# Altium schematic sheet Sheet1.SchDoc
size A4
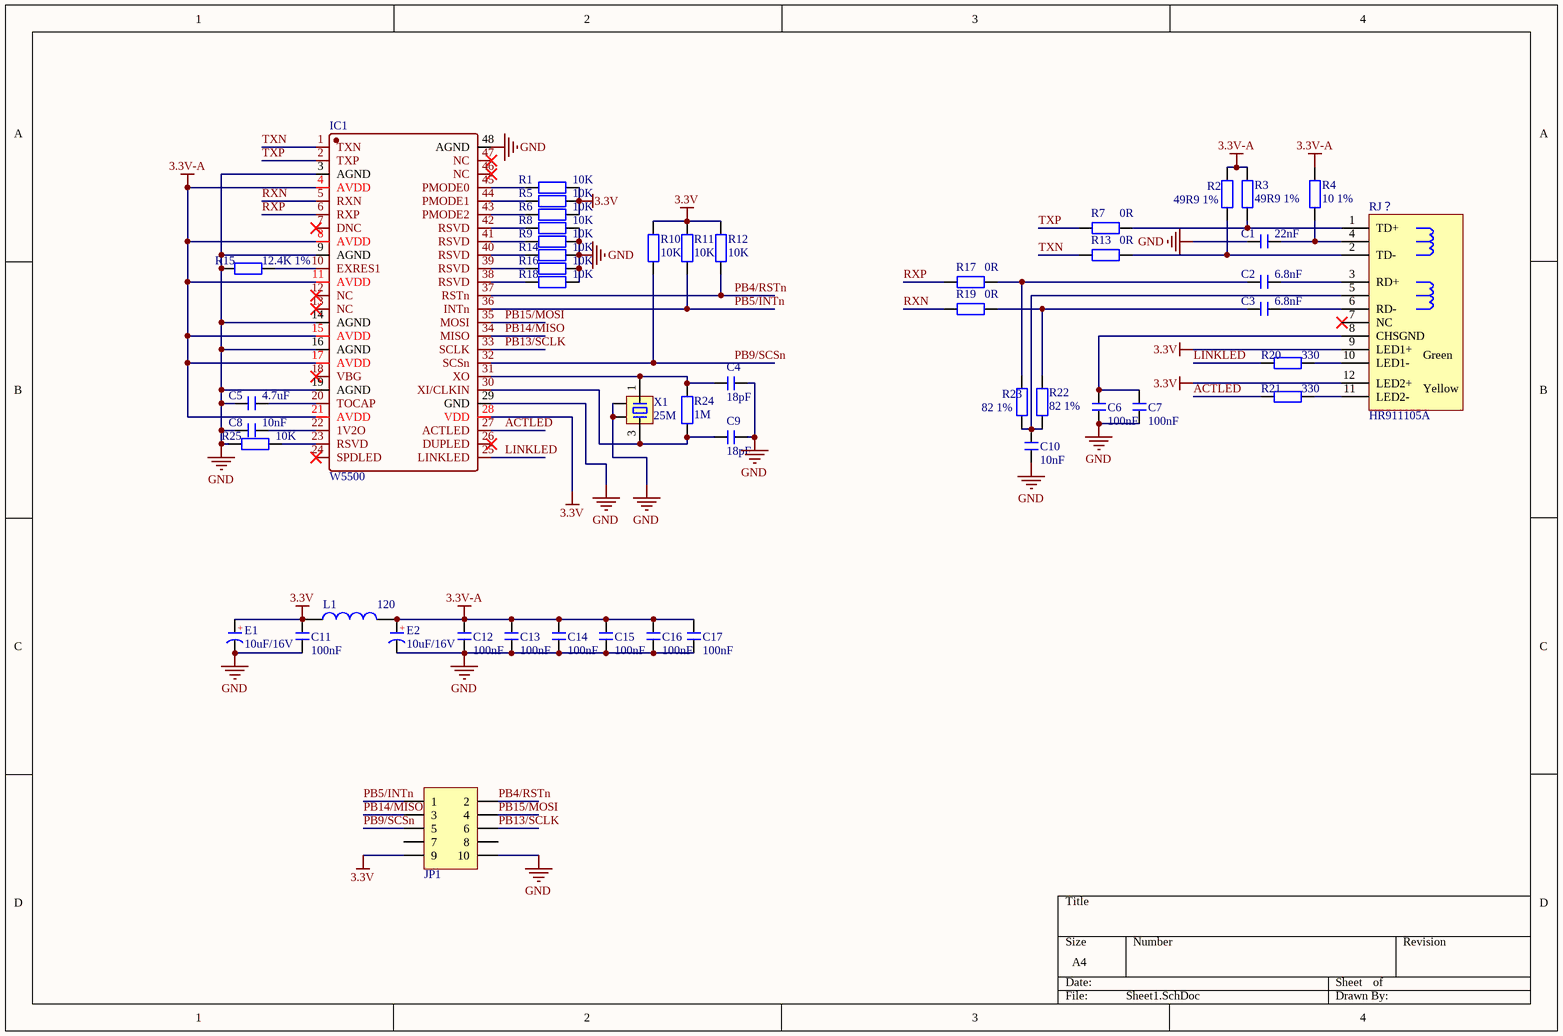
[diagram p0: Sheet1.SchDoc]

## Parts
C1  22nF  [C 0402_L]
C2  6.8nF  [C 0402_L]
C3  6.8nF  [C 0402_L]
C4  18pF  [C 0402_L]
C5  4.7uF  [C 0402_L]
C6  100nF  [C 0402_L]
C7  100nF  [C 0402_L]
C8  10nF  [C 0402_L]
C9  18pF  [C 0402_L]
C10  10nF  [C 0402_L]
C11  100nF  [C 0402_L]
C12  100nF  [C 0402_L]
C13  100nF  [C 0402_L]
C14  100nF  [C 0402_L]
C15  100nF  [C 0402_L]
C16  100nF  [C 0402_L]
C17  100nF  [C 0402_L]
E1  10uF/16V  [CD A(3216)]
E2  10uF/16V  [CD A(3216)]
IC1  W5500  [LQFP48-7*7]
JP1  Header 5X2  [HDR2.54-LI-2x5P]  (value not drawn)
L1  120  [L 0402]
R1  10K  [R 0402_L]
R2  49R9 1%  [R 0402_L]
R3  49R9 1%  [R 0402_L]
R4  10 1%  [R 0402_L]
R5  10K  [R 0402_L]
R6  10K  [R 0402_L]
R7  0R  [R 0402_L]
R8  10K  [R 0402_L]
R9  10K  [R 0402_L]
R10  10K  [R 0402_L]
R11  10K  [R 0402_L]
R12  10K  [R 0402_L]
R13  0R  [R 0402_L]
R14  10K  [R 0402_L]
R15  12.4K 1%  [R 0402_L]
R16  10K  [R 0402_L]
R17  0R  [R 0402_L]
R18  10K  [R 0402_L]
R19  0R  [R 0402_L]
R20  330  [R 0402_L]
R21  330  [R 0402_L]
R22  82 1%  [R 0402_L]
R23  82 1%  [R 0402_L]
R24  1M  [R 0402_L]
R25  10K  [R 0402_L]
RJ？  HR911105A  [RJ-45A12]
X1  25M  [OSC 3225-4P]

## Nets
3.3V: C11.2 E1.1(A) IC1.28(VDD) JP1.9 L1.1 R1.2 R5.2 R6.2 R10.2 R11.2 R12.2 RJ？.9(LED1+) RJ？.12(LED2+)
3.3V-A: C12.1 C13.1 C14.1 C15.1 C16.1 C17.1 E2.1(A) IC1.4(AVDD) IC1.8(AVDD) IC1.11(AVDD) IC1.15(AVDD) IC1.17(AVDD) IC1.21(AVDD) L1.2 R2.2 R3.2 R4.2
GND: C1.2 C4.1 C5.2 C6.1 C7.1 C8.2 C9.1 C10.2 C11.1 C12.2 C13.2 C14.2 C15.2 C16.2 C17.2 E1.2(K) E2.2(K) IC1.3(AGND) IC1.9(AGND) IC1.14(AGND) IC1.16(AGND) IC1.19(AGND) IC1.29(GND) IC1.48(AGND) JP1.10 R8.2 R9.2 R14.2 R15.1 R16.2 R18.2 R25.1 X1.2 X1.4
ACTLED: IC1.27(ACTLED) R21.2
LINKLED: IC1.25(LINKLED) R20.2
PB4/RSTn: IC1.37(RSTn) JP1.2 R12.1
PB5/INTn: IC1.36(INTn) JP1.1 R11.1
PB9/SCSn: IC1.32(SCSn) JP1.5 R10.1
PB13/SCLK: IC1.33(SCLK) JP1.6
PB14/MISO: IC1.34(MISO) JP1.3
PB15/MOSI: IC1.35(MOSI) JP1.4
RXN: IC1.5(RXN) R19.2
RXP: IC1.6(RXP) R17.2
TXN: IC1.1(TXN) R13.2
TXP: IC1.2(TXP) R7.2
NetC1_1: C1.1 R4.1 RJ？.4
NetC2_1: C2.1 RJ？.3(RD+)
NetC2_2: C2.2 R17.1 R23.2
NetC3_1: C3.1 RJ？.6(RD-)
NetC3_2: C3.2 R19.1 R22.1
NetC4_2: C4.2 IC1.31(XO) R24.2 X1.1
NetC5_1: C5.1 IC1.20(TOCAP)
NetC6_2: C6.2 C7.2 RJ？.8(CHSGND)
NetC8_1: C8.1 IC1.22(1V2O)
NetC9_2: C9.2 IC1.30(XI/CLKIN) R24.1 X1.3
NetC10_1: C10.1 R22.2 R23.1 RJ？.5
NetIC1_10: IC1.10(EXRES1) R15.2
NetIC1_23: IC1.23(RSVD) R25.2
NetIC1_38: IC1.38(RSVD) R18.1
NetIC1_39: IC1.39(RSVD) R16.1
NetIC1_40: IC1.40(RSVD) R14.1
NetIC1_41: IC1.41(RSVD) R9.1
NetIC1_42: IC1.42(RSVD) R8.1
NetIC1_43: IC1.43(PMODE2) R6.1
NetIC1_44: IC1.44(PMODE1) R5.1
NetIC1_45: IC1.45(PMODE0) R1.1
NetR2_1: R2.1 R13.1 RJ？.2(TD-)
NetR3_1: R3.1 R7.1 RJ？.1(TD+)
NetR20_1: R20.1 RJ？.10(LED1-)
NetR21_1: R21.1 RJ？.11(LED2-)

Not connected (* = marked no-connect by the designer): IC1 7(DNC)* 12(NC)* 13(NC)* 18(VBG)* 24(SPDLED)* 26(DUPLED)* 46(NC)* 47(NC)*; JP1 7 8; RJ？ 7(NC)*

## Notes on the sheet
- (in symbol CT) +
- (in symbol HR911105A) Green; Yellow

## Library data of the parts
C1-C17 = C: 贴片电容; BOM名称: 无极性贴片电容; 淘宝ID: 封装库来自淘宝 ID：黄晶宝石; 联系售后，技术支持: https://shop463601444.taobao.com; 唯一出售店铺网址: https://shop463601444.taobao.com
E1 E2 = CT: 贴片钽电容; 淘宝ID: 封装库来自淘宝 ID：黄晶宝石; BOM名称: 贴片钽电容; 联系售后: https://shop463601444.taobao.com
IC1 = W5500: 网口芯片
JP1 = Header 5X2: 5*2P接插件; 版权归属: 封装库来自淘宝 ID：黄晶宝石; BOM名称: 5*2P接插件; 学习资源: https://shop463601444.taobao.com
L1 = L: 小功率贴片电感; 淘宝ID: 封装库来自淘宝 ID：黄晶宝石; 封装库来自淘宝卖家 ID：黄晶宝石: 其他店铺购入均为盗版，不享受售后技术支持服务，请立即申请退款; BOM名称: 小功率贴片电感; 联系售后: https://shop463601444.taobao.com
R1-R25 = R: 贴片电阻; 版权归属: 来自淘宝 ID：黄晶宝石; 封装库来自淘宝卖家 ID：黄晶宝石: 其他店铺购入均为盗版，不享受售后技术支持服务，请立即申请退款; BOM名称: 贴片电阻; 联系售后: https://shop463601444.taobao.com
RJ？ = HR911105A: 带灯以太网接口; 版权归属: 封装库来自淘宝 ID：黄晶宝石; BOM名称: 带灯以太网接口; 学习资源: https://shop463601444.taobao.com
X1 = XTAL-4P: 4脚无源晶振; 版权归属: 封装库来自淘宝卖家 ID：黄晶宝石; BOM名称: 4脚无源晶振; 学习资源: https://shop463601444.taobao.com